# Altium schematic sheet Firefly.SchDoc
size A
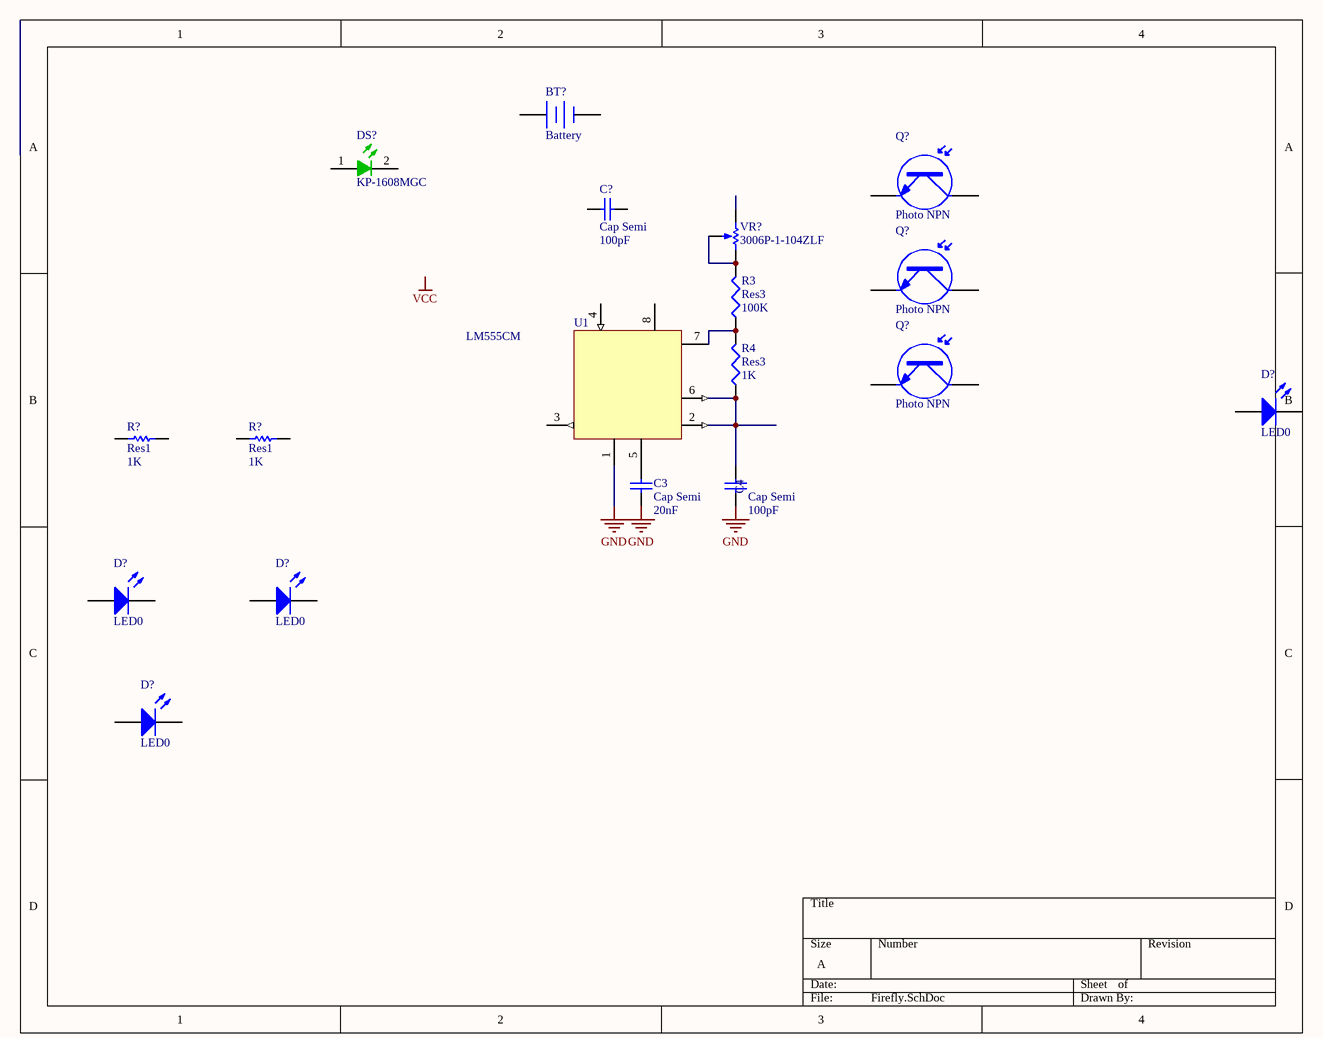
[diagram p0: Firefly.SchDoc]

## Parts
(Parts that share a designator on the sheet are numbered #1, #2 ... from top to bottom, then left to right.)
BT?  Battery  [BAT-2]
C3  Cap Semi  value 20nF  [C1206]
C4  Cap Semi  value 100pF  [C1206]
C?  Cap Semi  value 100pF  [C2512]
D?#1  LED0  [LED-0]
D?#2  LED0  [LED-0]
D?#3  LED0  [LED-0]
D?#4  LED0  [LED-0]
DS?  KP-1608MGC  [KING-0603LED_GREEN_V]
Q?#1  Photo NPN  [TO-220_A]
Q?#2  Photo NPN  [TO-220_A]
Q?#3  Photo NPN  [TO-220_A]
R3  Res3  value 100K  [14-1210]
R4  Res3  value 1K  [14-1210]
R?#1  Res1  value 1K  [AXIAL-0.3]
R?#2  Res1  value 1K  [AXIAL-0.3]
U1  LM555CM  [M08A_N]
VR?  3006P-1-104ZLF  [BOUR-3006P-3_V]

## Nets
GND: C3.1 C4.1 U1.1(GND)
NetC3_2: C3.2 U1.5(CVOLT)
NetC4_2: C4.2 R4.1
NetR3_1: R3.1 R4.2 U1.7(DIS)
NetR3_2: R3.2 VR?.1(CCW) VR?.2(WIPER)

Not connected (* = marked no-connect by the designer): BT? 1(+) 2(-); C? 1 2; D?#1 1(A) 2(K); D?#2 1(A) 2(K); D?#3 1(A) 2(K); D?#4 1(A) 2(K); DS? 1(A) 2(K); Q?#1 1(C) 3(E); Q?#2 1(C) 3(E); Q?#3 1(C) 3(E); R?#1 1 2; R?#2 1 2; U1 2(TRIG) 3(OUT) 4(RST) 6(THR) 8(+VCC); VR? 3(CW)

## Notes on the sheet
- Labels drawn without touching a wire or pin: VCC

## Library data of the parts
BT? = Battery: Multicell Battery; Published: 24-Mar-1999; LatestRevisionDate: 17-Jul-2002; LatestRevisionNote: Re-released for DXP Platform.; PackageReference: BAT-2; Publisher: Altium Limited; PackageDescription: Battery; 2 Leads
C3 C4 C? = Cap Semi: Capacitor (Semiconductor SIM Model); Published: 8-Jun-2000; LatestRevisionDate: 29-May-2009; LatestRevisionNote: IPC-7351 Footprint Added.; PackageReference: C1206; Publisher: Altium Limited; PackageDescription: Chip Capacitor
D?#1-D?#4 = LED0: Typical INFRARED GaAs LED; Published: 8-Jun-2000; LatestRevisionDate: 08-Jul-2005; LatestRevisionNote: Mech Layer 1 removed.; PackageReference: LED-0; Publisher: Altium Limited; PackageDescription: LED; 2 Leads
DS? = CMP-0404-00001-1: LED, SMT, 0603(1608), 1.1mm thickness, Green; Manufacturer: Kingbright; Reverse Voltage: 5 V; Power Dissipation: 75 mW; Forward Current: 30 mA; Packing Type: 2000 pcs / reel; Mounting Technology: Surface Mount; Storage Temperature: -40 to +85 degC; ComponentLink1URL: http://www.kingbright.com/; PackageDescription: 2-Pin SMT LED, 1.6 x 0.8 mm Pitch; PartNumber: KP-1608MGC; PackageReference: 0603LED_GREEN; ComponentLink1Description: Manufacturer URL
Q?#1-Q?#3 = Photo NPN: NPN Phototransistor; Published: 24-Mar-1999; LatestRevisionDate: 17-Jul-2002; LatestRevisionNote: Re-released for DXP Platform.; PackageReference: TO-220_A; Publisher: Altium Limited; Code_JEDEC: TO-220-AC
R3 R4 = Res3: Resistor; Published: 8-Jun-2000; LatestRevisionDate: 29-May-2009; LatestRevisionNote: IPC-7351 Footprint Added.; PackageReference: J1-0603; Publisher: Altium Limited; PackageDescription: Chip Resistor
R?#1 R?#2 = Res1: Resistor; Published: 8-Jun-2000; LatestRevisionDate: 17-Jul-2002; LatestRevisionNote: Re-released for DXP Platform.; PackageReference: AXIAL-0.3; Publisher: Altium Limited; PackageDescription: Axial Device, Thru-Hole; 2 Leads; 0.3 in Pin Spacing
U1 = CMP-0056-00108-2: Timer, 8-pin Narrow SOIC; Manufacturer: National Semiconductor; CompType: Analog IC; PackageTopMarking: NSZXTT*LM*555CM; PowerWise: N; DatasheetVersion: Jul-2006; ComponentLink3Description: M08A Package Page; Code_JEDEC: MS-012-AA; ComponentLink1URL: http://www.national.com/ds/LM/LM555.pdf; ComponentLink1Description: LM555 Datasheet; RoHS: N; ComponentLink3URL: http://www.national.com/packaging/folders/m08a.html; PackageVersion: revM, May-2009; PinCount: 8; PackageDescription: SOIC Narrow, 4.9 x 3.9 x 1.45mm, 8 Lead, 1.27mm Pitch; ComponentLink2URL: http://www.national.com/pf/LM/LM555.html; RevisionNote: Component URLs added; ComponentLink2Description: LM555 Web Page; PackageReference: M08A; Code_IPC: SOIC127P600-8
VR? = CMP-0975-00010-1: Trimming Potentiometer, 100K Ohm +/- 10%, -55 to 125 degC, 3-Pin 19.05 x 4.83 x 6.6 mm THD, RoHS; Manufacturer: Bourns; Rotational Life: 200 Cycles; Resistance Tolerance: +/- 10%; Resistance (kOhm): 100; Number of Turns: 15; ComponentLink1Description: Manufacturer URL; ComponentLink1URL: http://www.bourns.com/; ComponentLink2URL: http://www.bourns.com/data/global/pdfs/3006.pdf; DatasheetVersion: Apr-14; PartNumber: 3006P-1-104ZLF; ComponentLink3URL: http://www.bourns.com/data/global/pdfs/3006.pdf; PackageDescription: 3-Pin THD, Body 19.05 x 4.83 mm, Height 6.6 mm; Temperature Range: -55 to 125 degC; ComponentLink3Description: Package Specification; RoHS: TRUE; ComponentLink2Description: Datasheet; PackageReference: 3006P-3; PackageVersion: Apr-14; Mounting Technology: Through Hole